# Altium schematic sheet amplifier.SchDoc
size A
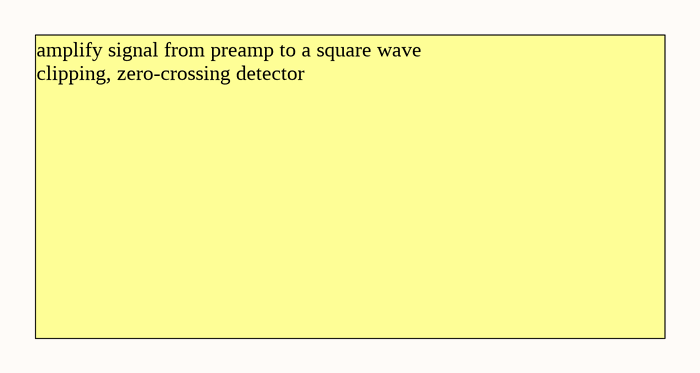
[diagram p0: amplifier.SchDoc]

## Notes on the sheet
- amplify signal from preamp to a square wave
  clipping, zero-crossing detector